# Altium schematic sheet MCU.SchDoc: MCU
size A3; DocumentNumber: 1; SheetNumber: 1
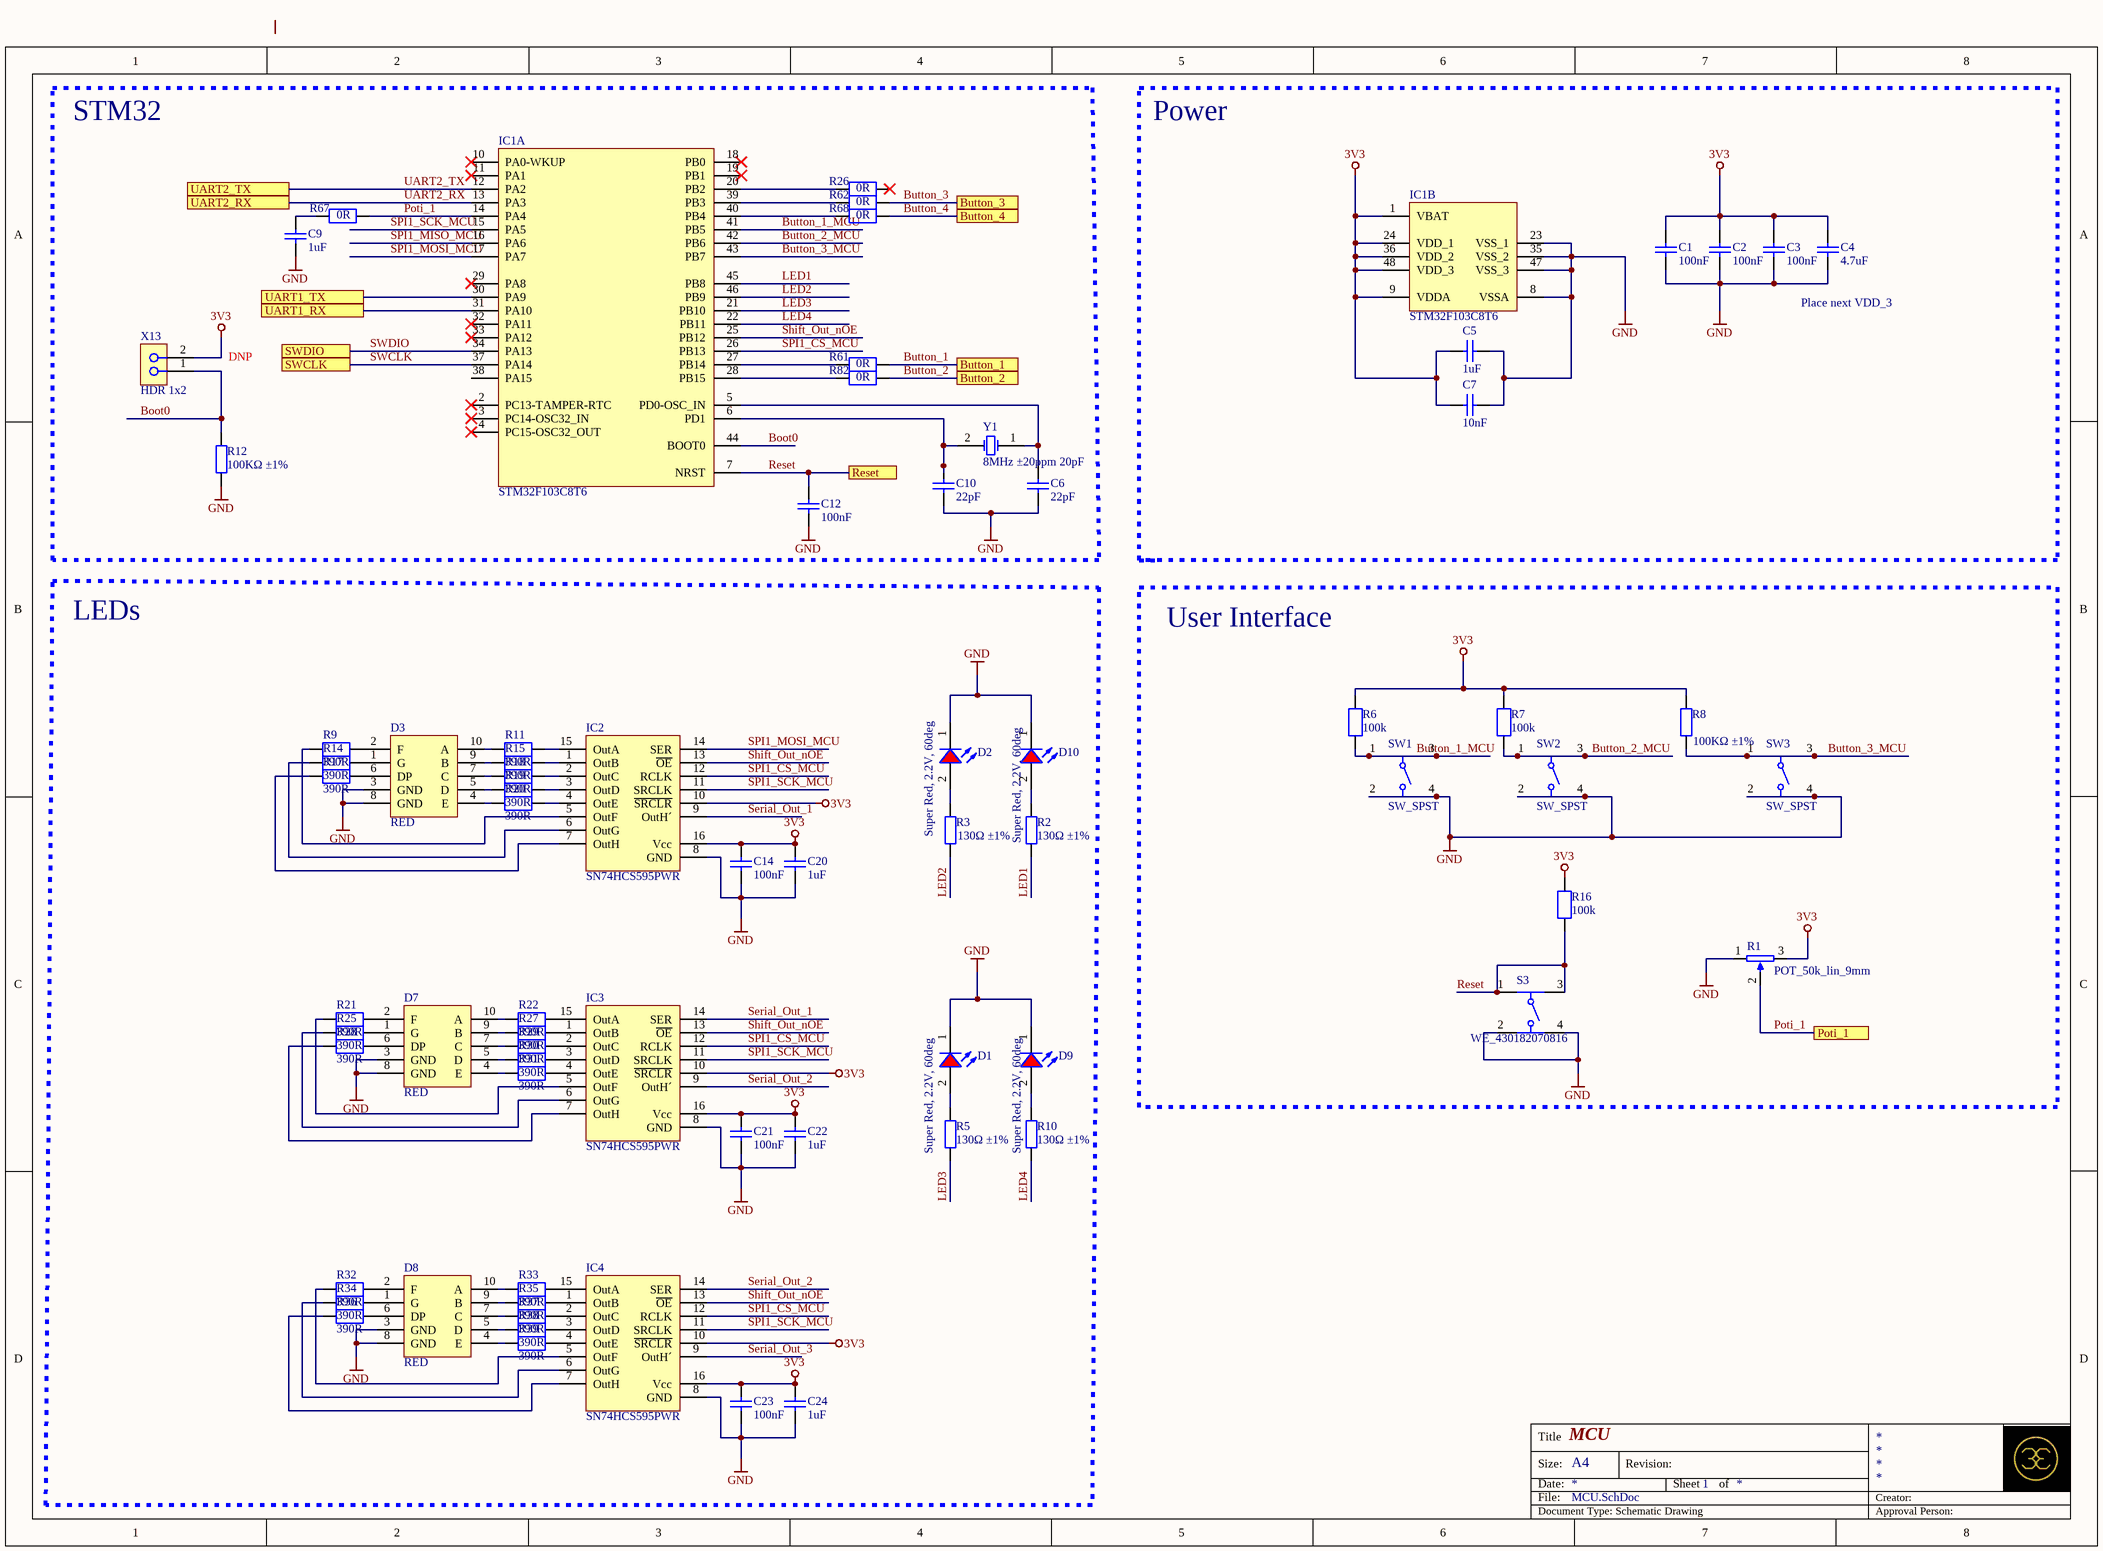
[diagram p0: MCU.SchDoc]

## Parts
C1  100nF  [0603_C]
C2  100nF  [0603_C]
C3  100nF  [0603_C]
C4  4.7uF  [0603_C]
C5  1uF  [0603_C]
C6  22pF  [0603_C]
C7  10nF  [0603_C]
C9  1uF  [0603_C]
C10  22pF  [0603_C]
C12  100nF  [0603_C]
C14  100nF  [0603_C]
C20  1uF  [0603_C]
C21  100nF  [0603_C]
C22  1uF  [0603_C]
C23  100nF  [0603_C]
C24  1uF  [0603_C]
D1  Super Red, 2.2V, 60deg  [WL-TMRC_3mm_10mm_space]
D2  Super Red, 2.2V, 60deg  [WL-TMRC_3mm_10mm_space]
D3  RED  [LTS-4301WC]
D7  RED  [LTS-4301WC]
D8  RED  [LTS-4301WC]
D9  Super Red, 2.2V, 60deg  [WL-TMRC_3mm_10mm_space]
D10  Super Red, 2.2V, 60deg  [WL-TMRC_3mm_10mm_space]
IC1  STM32F103C8T6  [LQFP-48_7x7x05P]  (parts A,B of 2)
IC2  SN74HCS595PWR  [TSOP65P640X120-16N_2]
IC3  SN74HCS595PWR  [TSOP65P640X120-16N_2]
IC4  SN74HCS595PWR  [TSOP65P640X120-16N_2]
R1  POT_50k_lin_9mm  [PTV09]
R2  130Ω ±1%  [0603_R]
R3  130Ω ±1%  [0603_R]
R5  130Ω ±1%  [0603_R]
R6  100k  [RESC2012X70N]
R7  100k  [RESC2012X70N]
R8  100KΩ ±1%  [0603_R]
R9  390R  [RESC2012X70N]
R10  130Ω ±1%  [0603_R]
R11  390R  [RESC2012X70N]
R12  100KΩ ±1%  [0603_R]
R14  390R  [RESC2012X70N]
R15  390R  [RESC2012X70N]
R16  100k  [RESC2012X70N]
R17  390R  [RESC2012X70N]
R18  390R  [RESC2012X70N]
R19  390R  [RESC2012X70N]
R20  390R  [RESC2012X70N]
R21  390R  [RESC2012X70N]
R22  390R  [RESC2012X70N]
R25  390R  [RESC2012X70N]
R26  0R  [RESC1608X55N]
R27  390R  [RESC2012X70N]
R28  390R  [RESC2012X70N]
R29  390R  [RESC2012X70N]
R30  390R  [RESC2012X70N]
R31  390R  [RESC2012X70N]
R32  390R  [RESC2012X70N]
R33  390R  [RESC2012X70N]
R34  390R  [RESC2012X70N]
R35  390R  [RESC2012X70N]
R36  390R  [RESC2012X70N]
R37  390R  [RESC2012X70N]
R38  390R  [RESC2012X70N]
R39  390R  [RESC2012X70N]
R61  0R  [RESC1608X55N]
R62  0R  [RESC1608X55N]
R67  0R  [RESC1608X55N]
R68  0R  [RESC1608X55N]
R82  0R  [RESC1608X55N]
S3  WE_430182070816  [430182070816]
SW1  SW_SPST  [TL1105D]
SW2  SW_SPST  [TL1105D]
SW3  SW_SPST  [TL1105D]
X13  HDR 1x2  [CON_HEADER2.54_1x2W]
Y1  8MHz ±20ppm 20pF  [SMD-5032_2P]

## Blocks framed on the sheet
STM32: C6 C9 C10 C12 IC1 R12 R26 R61 R62 R67 R68 R82 X13 Y1
LEDs: C14 C20-C24 D1-D3 D7-D10 IC2-IC4 R2 R3 R5 R9-R11 R14 R15 R17-R22 R25 R27-R39
User Interface: R1 R6-R8 R16 S3 SW1-SW3

## Ports
Button_1, Button_2, Button_3, Button_4, Poti_1, Reset, SWCLK, SWDIO, UART1_RX, UART1_TX, UART2_RX, UART2_TX

## Nets
3V3: C1.2 C2.2 C3.2 C4.2 C5.1 C7.1 C14.2 C20.2 C21.2 C22.2 C23.2 C24.2 IC1.1(VBAT) IC1.9(VDDA) IC1.24(VDD_1) IC1.36(VDD_2) IC1.48(VDD_3) IC2.10(~{SRCLR}) IC2.16(Vcc) IC3.10(~{SRCLR}) IC3.16(Vcc) IC4.10(~{SRCLR}) IC4.16(Vcc) R1.3 R6.2 R7.2 R8.2 R16.2 X13.2
GND: C1.1 C2.1 C3.1 C4.1 C5.2 C6.2 C7.2 C9.2 C10.2 C12.1 C14.1 C20.1 C21.1 C22.1 C23.1 C24.1 D1.1(K) D2.1(K) D3.3(GND) D3.8(GND) D7.3(GND) D7.8(GND) D8.3(GND) D8.8(GND) D9.1(K) D10.1(K) IC1.8(VSSA) IC1.23(VSS_1) IC1.35(VSS_2) IC1.47(VSS_3) IC2.8(GND) IC3.8(GND) IC4.8(GND) R1.1 R12.1 S3.2 S3.4 SW1.2 SW1.4 SW2.2 SW2.4 SW3.2 SW3.4
Boot0: IC1.44(BOOT0) R12.2 X13.1
Button_1: R61.2 ; port Button_1
Button_1_MCU: IC1.41(PB5) R6.1 SW1.1 SW1.3
Button_2: R82.2 ; port Button_2
Button_2_MCU: IC1.42(PB6) R7.1 SW2.1 SW2.3
Button_3: R62.2 ; port Button_3
Button_3_MCU: IC1.43(PB7) R8.1 SW3.1 SW3.3
Button_4: R68.2 ; port Button_4
LED1: IC1.45(PB8) R2.2
LED2: IC1.46(PB9) R3.2
LED3: IC1.21(PB10) R5.2
LED4: IC1.22(PB11) R10.2
Poti_1: IC1.14(PA4) R1.2 R67.2 ; port Poti_1
Reset: C12.2 IC1.7(NRST) R16.1 S3.1 S3.3 ; port Reset
Serial_Out_1: IC2.9(OutH´) IC3.14(SER)
Serial_Out_2: IC3.9(OutH´) IC4.14(SER)
Serial_Out_3: IC4.9(OutH´)
Shift_Out_nOE: IC1.25(PB12) IC2.13(~{OE}) IC3.13(~{OE}) IC4.13(~{OE})
SPI1_CS_MCU: IC1.26(PB13) IC2.12(RCLK) IC3.12(RCLK) IC4.12(RCLK)
SPI1_MISO_MCU: IC1.16(PA6)
SPI1_MOSI_MCU: IC1.17(PA7) IC2.14(SER)
SPI1_SCK_MCU: IC1.15(PA5) IC2.11(SRCLK) IC3.11(SRCLK) IC4.11(SRCLK)
SWCLK: IC1.37(PA14) ; port SWCLK
SWDIO: IC1.34(PA13) ; port SWDIO
UART1_RX: IC1.31(PA10) ; port UART1_RX
UART1_TX: IC1.30(PA9) ; port UART1_TX
UART2_RX: IC1.13(PA3) ; port UART2_RX
UART2_TX: IC1.12(PA2) ; port UART2_TX
NetC6_1: C6.1 IC1.5(PD0-OSC_IN) Y1.1(OSC1)
NetC9_1: C9.1 R67.1
NetC10_1: C10.1 IC1.6(PD1) Y1.2(OSC2)
NetD1_2: D1.2(A) R5.1
NetD2_2: D2.2(A) R3.1
NetD3_1: D3.1(G) R14.2
NetD3_2: D3.2(F) R9.2
NetD3_4: D3.4(E) R20.1
NetD3_5: D3.5(D) R19.1
NetD3_6: D3.6(DP) R17.2
NetD3_7: D3.7(C) R18.1
NetD3_9: D3.9(B) R15.1
NetD3_10: D3.10(A) R11.1
NetD7_1: D7.1(G) R25.2
NetD7_2: D7.2(F) R21.2
NetD7_4: D7.4(E) R31.1
NetD7_5: D7.5(D) R30.1
NetD7_6: D7.6(DP) R28.2
NetD7_7: D7.7(C) R29.1
NetD7_9: D7.9(B) R27.1
NetD7_10: D7.10(A) R22.1
NetD8_1: D8.1(G) R34.2
NetD8_2: D8.2(F) R32.2
NetD8_4: D8.4(E) R39.1
NetD8_5: D8.5(D) R38.1
NetD8_6: D8.6(DP) R36.2
NetD8_7: D8.7(C) R37.1
NetD8_9: D8.9(B) R35.1
NetD8_10: D8.10(A) R33.1
NetD9_2: D9.2(A) R10.1
NetD10_2: D10.2(A) R2.1
NetIC1_20: IC1.20(PB2) R26.1
NetIC1_27: IC1.27(PB14) R61.1
NetIC1_28: IC1.28(PB15) R82.1
NetIC1_39: IC1.39(PB3) R62.1
NetIC1_40: IC1.40(PB4) R68.1
NetIC2_1: IC2.1(OutB) R15.2
NetIC2_2: IC2.2(OutC) R18.2
NetIC2_3: IC2.3(OutD) R19.2
NetIC2_4: IC2.4(OutE) R20.2
NetIC2_5: IC2.5(OutF) R9.1
NetIC2_6: IC2.6(OutG) R14.1
NetIC2_7: IC2.7(OutH) R17.1
NetIC2_15: IC2.15(OutA) R11.2
NetIC3_1: IC3.1(OutB) R27.2
NetIC3_2: IC3.2(OutC) R29.2
NetIC3_3: IC3.3(OutD) R30.2
NetIC3_4: IC3.4(OutE) R31.2
NetIC3_5: IC3.5(OutF) R21.1
NetIC3_6: IC3.6(OutG) R25.1
NetIC3_7: IC3.7(OutH) R28.1
NetIC3_15: IC3.15(OutA) R22.2
NetIC4_1: IC4.1(OutB) R35.2
NetIC4_2: IC4.2(OutC) R37.2
NetIC4_3: IC4.3(OutD) R38.2
NetIC4_4: IC4.4(OutE) R39.2
NetIC4_5: IC4.5(OutF) R32.1
NetIC4_6: IC4.6(OutG) R34.1
NetIC4_7: IC4.7(OutH) R36.1
NetIC4_15: IC4.15(OutA) R33.2

Not connected (* = marked no-connect by the designer): IC1 2(PC13-TAMPER-RTC)* 3(PC14-OSC32_IN)* 4(PC15-OSC32_OUT)* 10(PA0-WKUP)* 11(PA1)* 18(PB0)* 19(PB1)* 29(PA8)* 32(PA11)* 33(PA12)* 38(PA15); R26 2*

## Notes on the sheet
- Power
- DNP
- Place next VDD_3
- Title
- Size:
- Date:
- File:
- A4
- Revision:
- Sheet
- of
- Creator:
- Document Type: Schematic Drawing
- Approval Person:

## Library data of the parts
C1-C3 C12 C14 C21 C23 = 0603 100nF (104) 10% 50V: Chip capacitors; Manufacturer: YAGEO; PartNumber: CC0603KRX7R9BB104; Tolerance: 10%; Voltage: 50V; ComponentLink1Description: Supplier link; ComponentLink1URL: http://www.szlcsc.com/product/details_15331.html; Package: 0603; Supplier: LC; SuppliersPartNumber: C14663; Capacitance: 100nF
C4 = 0603 4.7uF (475) 10% 16V: Chip capacitors; Manufacturer: Samsung Electro-Mechanics; PartNumber: CL10A475KO8NNNC; Tolerance: 10%; Voltage: 16V; ComponentLink1Description: Supplier link; ComponentLink1URL: http://www.szlcsc.com/product/details_20375.html; Package: 0603; Supplier: LC; SuppliersPartNumber: C19666; Capacitance: 4.7uF
C5 C9 C20 C22 C24 = 0603 1uF (105) 10% 50V: Chip capacitors; Manufacturer: Samsung Electro-Mechanics; PartNumber: CL10A105KB8NNNC; Tolerance: 10%; Voltage: 50V; ComponentLink1Description: Supplier link; ComponentLink1URL: http://www.szlcsc.com/product/details_16531.html; Package: 0603; Supplier: LC; SuppliersPartNumber: C15849; Capacitance: 1uF
C6 C10 = 0603 22pF (220) 5% 50V: Chip capacitors; Manufacturer: Samsung Electro-Mechanics; PartNumber: CL10C220JB8NNNC; Tolerance: 5%; Voltage: 50V; ComponentLink1Description: Supplier link; ComponentLink1URL: http://www.szlcsc.com/product/details_2005.html; Package: 0603; Supplier: LC; SuppliersPartNumber: C1653; Capacitance: 22pF
C7 = 0603 10nF (103) 10% 50V: Chip capacitors; Manufacturer: Guangdong Fenghua Advanced Tech; PartNumber: 0603B103K500NT; Tolerance: 10%; Voltage: 50V; ComponentLink1Description: Supplier link; ComponentLink1URL: http://www.szlcsc.com/product/details_58143.html; Package: 0603; Supplier: LC; SuppliersPartNumber: C57112; Capacitance: 10nF
D1 D2 D9 D10 = 151031SS06000_Spacer_10mm: WL-TMRC THT Mono-color Round Color, size 3mm, Super Red, 2.2V, 60deg; Luminous Intensity: 35mcd; Dominant Wavelength: 640nm; Peak Wavelength: 650nm; Chip Technology: AlGaAs; ComponentLink1Description: Manufacturer; ComponentLink1URL: http://www.we-online.de; ComponentLink2Description: Datasheet; ComponentLink2URL: https://katalog.we-online.de/led/datasheet/151031SS06000.pdf; Emitting Color: Super Red; Operating Temperature: -40 to +85degC; Mounting Technology: THT; Forward Voltage: 2.2V; Part Number: 151031SS06000; Packaging: Bulk; Published Date: October 2019; Publisher: Wurth Elektronik; Size: 3mm; Viewing Angle: 60deg
D3 D7 D8 = 7-SEGMENT-10mm: LED Displays & Accessories 1-Digit SMD Display Red Low-Cur .40; Manufacturer: Lite-On; Alternatives allowed: YES; Manufacturer Part Number: LTS-4301WC; JLC: C84256
IC1 = STM32F103C8T6: ARM; Manufacturer: STMicroelectronics; ComponentLink1Description: 供应商链接; ComponentLink1URL: http://www.szlcsc.com/product/details_9243.html; Manufacturer Part Number: STM32F103C8T6; JLC: C8734
IC2-IC4 = IC_SN74HCS595: Counter Shift Registers 8-bit serial-in/parallel-out shift register 16-TSSOP -40 to 125; Manufacturer: Texas Instruments; Alternatives allowed: NO; Manufacturer Part Number: SN74HCS595PWR
R1 = POT_50k_lin_9mm: Potentiometers PANEL CONTROL - 9MM-ST-CA 50 kohms 30 mm; Manufacturer: Bourns; Manufacturer Part Number: PTV09A-4030S-A503; Tolerance: 20%
R2 R3 R5 R10 = 0603 130R (1300) 1%: Chip resistor; Manufacturer: Uniroyal Elec; PartNumber: 0603WAF1300T5E; Power: 1/10W; ComponentLink1Description: Supplier link; ComponentLink1URL: http://www.szlcsc.com/product/details_23523.html; Package: 0603; Supplier: LC; SuppliersPartNumber: C22796; Resistance: 130Ω; Tolerance: 1%
R6 R7 R16 = RES_100k_0805: Thick Film Resistors - SMD 1/8watt 100Kohms 1% 100ppm; Manufacturer: Vishay / Dale; Manufacturer Part Number: CRCW0805100KFKEA; Voltage Rating: 150V; Alternatives allowed: YES; Tolerance: 1%; JLC: C17407
R8 R12 = 0603 100K (1003) 1%: Chip resistor; Manufacturer: Uniroyal Elec; PartNumber: 0603WAF1003T5E; Power: 1/10W; ComponentLink1Description: Supplier link; ComponentLink1URL: http://www.szlcsc.com/product/details_26546.html; Package: 0603; Supplier: LC; SuppliersPartNumber: C25803; Resistance: 100KΩ; Tolerance: 1%
R9 R11 R14 R15 R17-R22 R25 R27-R39 = RES_390R_0805: Thick Film Resistors - SMD 1/8Watt 390ohms 1% Commercial Use; Manufacturer: Vishay / Dale; Manufacturer Part Number: CRCW0805390RFKEA; Voltage Rating: 150V; Alternatives allowed: YES; Tolerance: 1%; JLC: C17655
R26 R61 R62 R67 R68 R82 = RES_0R_0603: Thick Film Resistors - SMD 1/10watt ZEROohm Jumper; Manufacturer: Vishay; Manufacturer Part Number: CRCW06030000Z0EA; Voltage Rating: 75V; Tolerance: 1%; Alternatives allowed: YES
S3 = WE_430182070816: WS-TASV SMT Tact Switch 6x6mm, height 7mm, 160gf; Rated Voltage: 12VDC; Rated Current: 50mA; Washable: No; ComponentLink1Description: Manufacturer; ComponentLink1URL: http://www.we-online.de; ComponentLink2Description: Datasheet; ComponentLink2URL: https://katalog.we-online.com/em/datasheet/430182070816.pdf; Operating Temperature: -40 to +85degC; Part Number: 430182070816; Published Date: September 2019; Contact Material: Stainless Steel; Height: 7mm; Mounting Technology: SMT; Contact Plating: Silver; Operation Force: 160gf; Packaging: Tape and Reel; Terminal Material: Copper Alloy; Publisher: Wurth Elektronik; Terminal Plating: Silver
SW1-SW3 = SW_ TL1105DF160Q: Tastschalter SPST-Schließer Von oben betätigt Durchkontaktierung; Manufacturer: E-Switch; Alternatives allowed: NO; Manufacturer Part Number: TL1105DF160Q
X13 = CON_HEADER_1X2: Board-to-Board-Steckverbinder, 2.54 mm, 2 Kontakt(e), Stiftleiste 1-Reihig; Manufacturer: Samtec; Manufacturer Part Number: TSW-102-07-T-S; Lumira Part Number: S-QMS-SPEC-32507; Alternatives allowed: YES
Y1 = SMD-5032_2P 8MHz 20ppm 20pF: 贴片晶振; ComponentLink1Description: 供应商链接; ComponentLink1URL: http://www.szlcsc.com/product/details_117214.html; Package: SMD-5032_2P; Supplier: LC; SuppliersPartNumber: C115962